# Altium schematic sheet Sheet1.SchDoc
size A; SheetNumber: 1; SheetTotal: 1
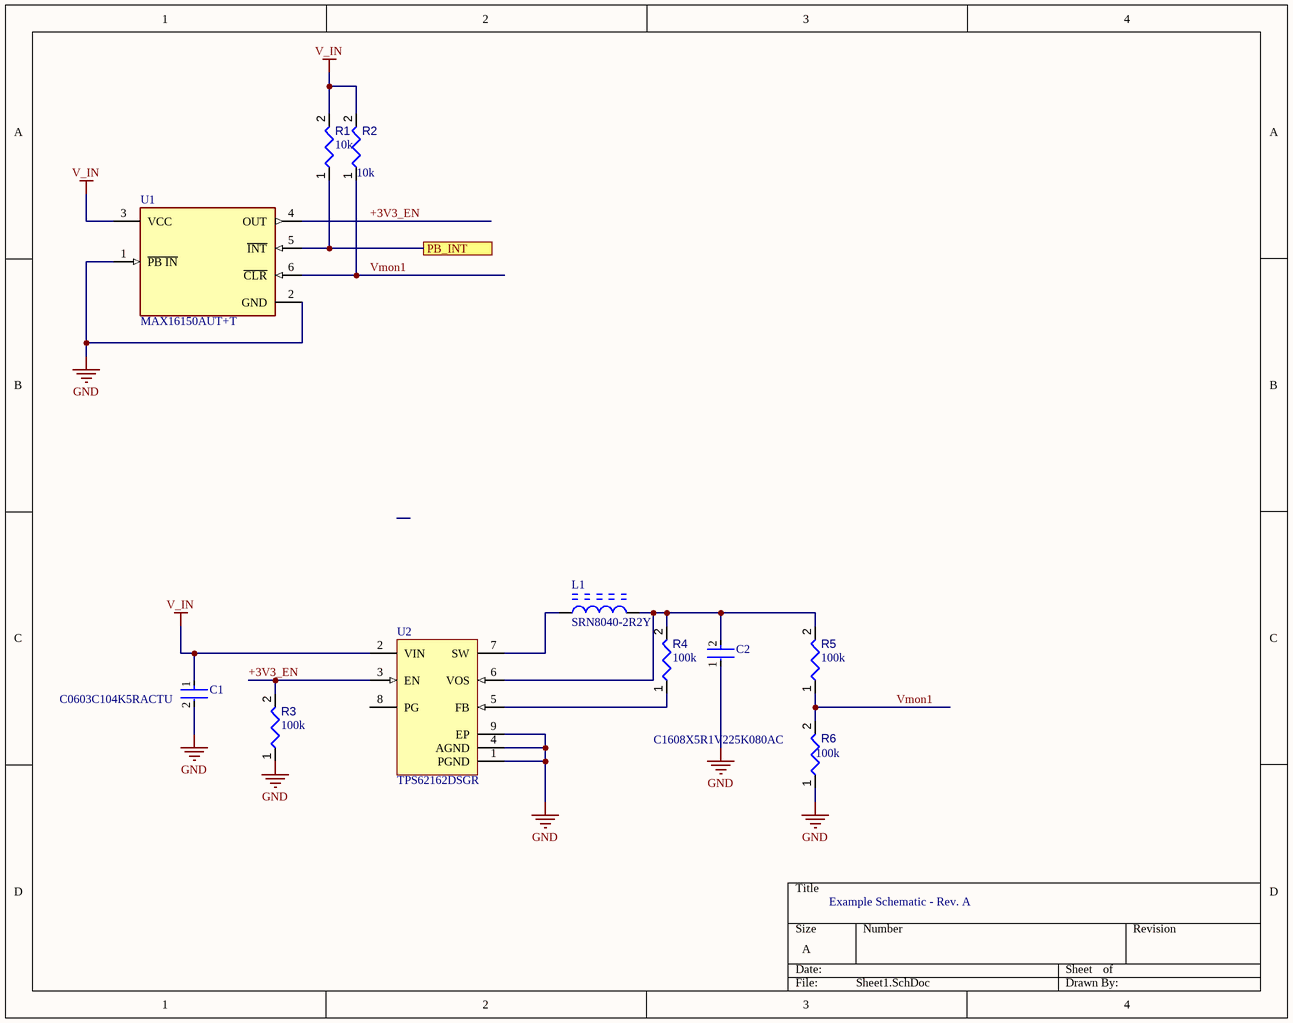
[diagram p0: Sheet1.SchDoc]

## Parts
C1  C0603C104K5RACTU  [FP-C0603C-CF-MFG]
C2  C1608X5R1V225K080AC  [FP-C1608-080-0_1-MFG]
L1  SRN8040-2R2Y  [BOUR-SRN8040_V]
R1  value 10k  [RESC1005X40X25ML05T05]  (hidden comment: Resistor 10k +/-1% 0402 100 mW)
R2  value 10k  [RESC1005X40X25ML05T05]  (hidden comment: Resistor 10k +/-1% 0402 100 mW)
R3  value 100k  [RESC1608X55X25ML10T15]  (hidden comment: Resistor 100k +/-1% 0603 100 mW)
R4  value 100k  [RESC1608X55X25ML10T15]  (hidden comment: Resistor 100k +/-1% 0603 100 mW)
R5  value 100k  [RESC1608X55X25ML10T15]  (hidden comment: Resistor 100k +/-1% 0603 100 mW)
R6  value 100k  [RESC1608X55X25ML10T15]  (hidden comment: Resistor 100k +/-1% 0603 100 mW)
U1  MAX16150AUT+T  [FP-U6-1-MFG]
U2  TPS62162DSGR  [DSG0008A_V]

## Ports
PB_INT

## Nets
GND: C1.2 C2.1 R3.1 R6.1 U1.1(~{PB_IN}) U1.2(GND) U2.1(PGND) U2.4(AGND) U2.9(EP)
V_IN: C1.1 R1.2 R2.2 U1.3(VCC) U2.2(VIN)
+3V3_EN: R3.2 U1.4(OUT) U2.3(EN)
PB_INT: R1.1 U1.5(~{INT}) ; port PB_INT
Vmon1: R2.1 R5.1 R6.2 U1.6(~{CLR})
NetC2_2: C2.2 L1.2 R4.2 R5.2 U2.6(VOS)
NetL1_1: L1.1 U2.7(SW)
NetR4_1: R4.1 U2.5(FB)

Not connected (* = marked no-connect by the designer): U2 8(PG)

## Notes on the sheet
- Example Schematic - Rev. A

## Library data of the parts
C1 = CMP-2006-03061-2: CAP CER 0.1UF 50V X7R 0603; Manufacturer: KEMET; Tolerance: 0.1; Description: C0603 0.10 μF X7R 30ppm/°C 10.00% 50 V; Temperature Coefficient: 30ppm/°C; Material: Ceramic; Automotive Grade: Grade 1; Value: 0.10 μF; Temperature: -55°C to +125°C; RoHS: TRUE; Temperature Range High: +125°C; Lead Free: Yes; Octopart: https://octopart.com/c0603c104k5ractu-kemet-139244; Digikey Description: CAP CER 0.1UF 50V X7R 0603; Category: Cap; Package: C0603C-CF; ComponentLink2Description: Datasheet; Temperature Range Low: -55°C; Device Class L1: Passive Components; Voltage Rating: 50 V; Automotive: Yes; Device Class L3: Ceramic Capacitors; ComponentLink2URL: https://api.kemet.com/component-edge/download/datasheet/C0603C100J5GACAUTO.pdf; Capacitance: 0.10 μF; Device Class L2: Capacitors; Manufacturer Part Number: C0603C104K5RACTU; Temperature Characteristic: X7R; Height: 0.87mm
C2 = CMP-08246-004960-1: Multilayer Ceramic Capacitors 2.2μF ±10% 35V X5R SMD 0603; Capacitance: 2.2uF; Dielectric Material: Ceramic; Length: 1.6mm; Height: 0.8mm; Package Quantity: 1; Width: 0.031inch; Radiation Hardening: No; Lead Free: Lead Free; Mount: Surface Mount; REACH SVHC: No SVHC; Construction: Flat; Voltage Rating (DC): 35V; Voltage Rating: 35V; Case/Package: 0603; Termination: SMD/SMT; Dielectric: X5R; Resistor Type: Ceramic; Thickness: 800um; Tolerance: 10%; Case Code (Metric): 1608; Case Code (Imperial): 0603; Weight: 7.1E-05oz; RoHS Compliant: Yes; Min Operating Temperature: -55°C; Series: C; Max Operating Temperature: 85°C; Depth: 0.8mm; Voltage: 35V; Packaging: Tape and Reel
L1 = CMP-2000-07144-1: Semi-Shielded Power Inductor, 2.2 uH, +/- 30%, 6.3 A, -40 to 125 degC, 2-Pin SMD, RoHS, Tape and Reel; Manufacturer: Bourns; Brand/Series: SRN8040Series; Current, Rating: 6.3A; Inductance: 2.2μH; Type: Power; Datasheet Version: 05/2015; Mounting Technology: SurfaceMount; Tolerance: ±30%; Datasheet URL: http://www.bourns.com/docs/Product-Datasheets/SRN8040.pdf; Package Reference: SRN8040; Termination: SMD; Manufacturer URL: http://www.bourns.com/; Package Description: 2-Pin Surface Mounted Device, Body 8 x 8 mm
R1 R2 = CMP-009-00015-5: Chip Resistor, 10 KOhm, +/- 1%, 0.1 W, -55 to 155 degC, 0402 (1005 Metric); Voltage Rating: 50V; Power: 100mW; Case/Package: 0402; RoHS Compliant: True; Min Operating Temperature: -55°C; Mounting Technology: SM; Tolerance: 1%; Max Operating Temperature: 155°C; Pins: 2
R3-R6 = CMP-009-00023-5: Chip Resistor, 100 KOhm, +/- 1%, 0.1 W, -55 to 155 degC, 0603 (1608 Metric); Voltage Rating: 50V; Power: 100mW; Max Operating Temperature: 155°C; RoHS Compliant: True; Tolerance: 1%; Pins: 2; Case/Package: 0603; Mounting Technology: SM; Min Operating Temperature: -55°C
U1 = CMP-05723-001129-1: IC SUPERVISOR 1 CHANNEL SOT23-6
U2 = CMP-0323-00316-3: Buck Step Down Regulator with 3 to 17 V Input and 3.3 V Output, -40 to 85 degC, 8-Pin WSON (DSG), Green (RoHS & no Sb/Br); Manufacturer: Texas Instruments; SubFamily: Step-Down Regulator; Synchronous Rectification: TRUE; Vout(Max)(V): 3.3; Regulated Outputs(#): 1; Switch Current Limit(Typ)(A): 1.8; Duty Cycle(Max)(%): 100; Iq(Typ)(mA): 0.017; Rating: Catalog; Vin(Min)(V): 3; Vin(Max)(V): 17; ComponentLink2URL: http://www.ti.com/litv/pdf/mpds308a; ComponentLink3URL: Samples URL:http://www.ti.com/product/tps62162#samples; Eco-Plan: Green (RoHS & no Sb/Br); PackageDescription: 8-Pin Plastic Small Outline No-Lead, 2 x 2 x 0.8 mm Body, 0.5 mm Pitch, Exposed Pad; DatasheetVersion: SLVSAM2A; Topology: Buck; PartNumber: TPS62162DSGR; PackageReference: DSG0008A; ComponentLink1URL: http://www.ti.com/general/docs/lit/getliterature.tsp?genericPartNumber=TPS62162&fileType=pdf; PackageVersion: revB, Oct-2010; Mounting Technology: Surface Mount; Code_JEDEC: MO-229; Iout(Max)(A): 1; ComponentLink1Description: Datasheet; ComponentLink2Description: Package Specification; Vout(Min)(V): 3.3; ComponentLink3Description: URL Link1; Preset Vout(V): 3.3